# EasyEDA Pro project EasyEDA BNO Pinout.epro

# Board BNO Pinout
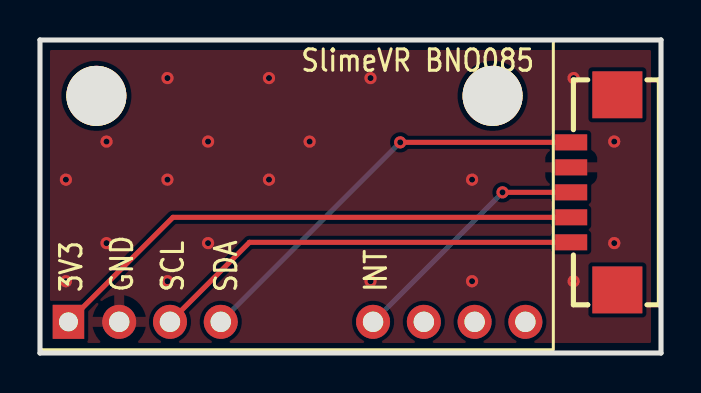
[diagram p0: board, top side]
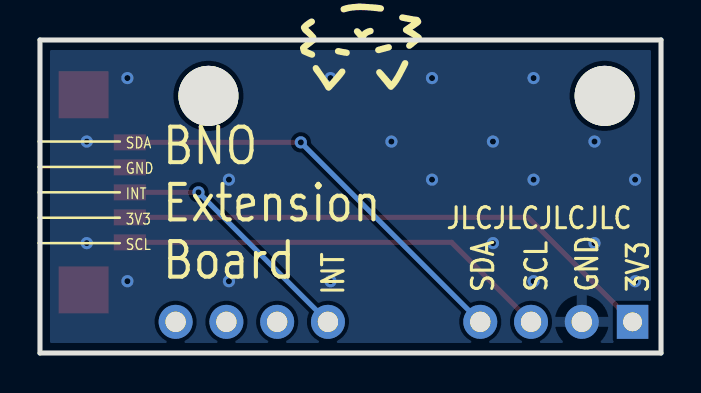
[diagram p1: board, bottom side, seen from below]

Outline 31.07 x 15.66 mm; copper layers: Top Layer, Bottom Layer. Coordinates in mm from the lower left corner of the outline.
Outline path: 0,15.66 31.07,15.66 31.07,0 0,0 0,15.66
Stack: Top Layer 0.035mm / Dielectric1 0.91mm FR4 er 4.5 / Bottom Layer 0.035mm

## Design rules (mm)
spacing Default (default): track to track 0.127, other pairs 0 to 0.127
track width Default (default): min 0.127, default 0.127, max 25.4
differential pair differentialPair (default): width min 0.127, default 0.254, max 2.54; gap min 0.152, default 0.152
via Default (default): diameter min 0.61, default 0.61, max 100.025; hole min 0.305, default 0.305, max 59.995
net GND uses gge20888(1)

## Placement (name value [footprint] x y rotation side)
CN1  HC-1.25-5PWT  [conn-smd_5p-p1.25_hctl_hc-1.25-5pwt]  27.59 8.04 90 top
CONN1  -  [hdr-th_10p-p2.54-v-m-1]  12.85 1.56 0 top
NOREF  -  [Pad_e3]  22.64 12.86 90 top
NOREF#2  -  [Pad_e0]  2.82 12.86 0 top

## Footprints (pads in the part's own frame, mm; a bottom-side part is the same pattern mirrored in y, then rotated)
conn-smd_5p-p1.25_hctl_hc-1.25-5pwt
  rect 0.8x1.6 smd: 1(-2.5,1.009) 2(-1.25,1.009) 3(0,1.009) 4(1.25,1.009) 5(2.5,1.009)
  rect 2.35x2.5 smd: 6(4.88,-1.3) 7(-4.88,-1.3)
hdr-th_10p-p2.54-v-m-1
  rect 1.575x1.7 hole 0.945: 1(-11.43,0)
  round 1.7 hole 1.02: 2(-8.89,0) 3(-6.35,0) 4(-3.81,0) 7(3.81,0) 8(6.35,0) 9(8.89,0) 10(11.43,0)
Pad_e0
  round 3 hole 3: 11(0,0)
Pad_e3
  round 3 hole 3: 11(0,0)

## Nets
3V3: CN1.2 CONN1.1
GND: CN1.4 CONN1.2
INT: CN1.3 CONN1.7
SCL: CN1.1 CONN1.3
SDA: CN1.5 CONN1.4

Pads without a net: CN1 6 7; CONN1 8 9 10; NOREF 11; NOREF#2 11

## Via types
v1: diameter 0.61, hole 0.305, Top Layer to Bottom Layer, 22 vias

## Routing (per net, layer and track width the routed paths; a pad name or vN(x,y) marks a point on that pad's centre or on a via; arc(x,y) is an arc through that point)
GND:
  vias: v1(1.3,8.67) v1(1.3,3.59) v1(3.33,10.58) v1(3.33,5.5) v1(6.38,13.75) v1(6.38,8.67) v1(6.38,3.59) v1(8.41,10.58) v1(8.41,5.5) v1(11.46,13.75) v1(11.46,8.67) v1(13.49,10.58) v1(16.54,13.75) v1(16.54,3.59) v1(21.62,8.67) v1(21.62,3.59) v1(26.7,13.75) v1(26.7,3.59) v1(28.73,10.58) v1(28.73,5.5)
INT: length 12.6
  Top Layer w0.254: v1(23.14,8.04) CN1.3
  Bottom Layer w0.254: CONN1.7 v1(23.14,8.04)
SDA: length 21.3
  Top Layer w0.254: v1(18.02,10.54) CN1.5
  Bottom Layer w0.254: CONN1.4 v1(18.02,10.54)
3V3: length 27.3
  Top Layer w0.254: CONN1.1 6.65,6.79 CN1.2
SCL: length 21.7
  Top Layer w0.254: CONN1.3 10.48,5.54 CN1.1

## Copper pours and planes (outline as drawn; the poured copper is in the pictures)
GND on Top Layer: -1.75,17.94 32.67,17.94 32.67,-4.66 -1.75,-4.66
GND on Bottom Layer: -3.78,18.7 34.82,18.7 34.82,-6.57 -3.78,-6.57

## Text on the board
Bottom Silkscreen Layer: SDA | GND | INT | 3V3 | SCL | JLCJLCJLCJLC | BNO / Extension / Board
Top Silkscreen Layer: SlimeVR BNO085 | 3V3 | GND | SCL | SDA | INT
